# EAGLE design L3D_Display_both_V4 (EAGLE 7.7.0)
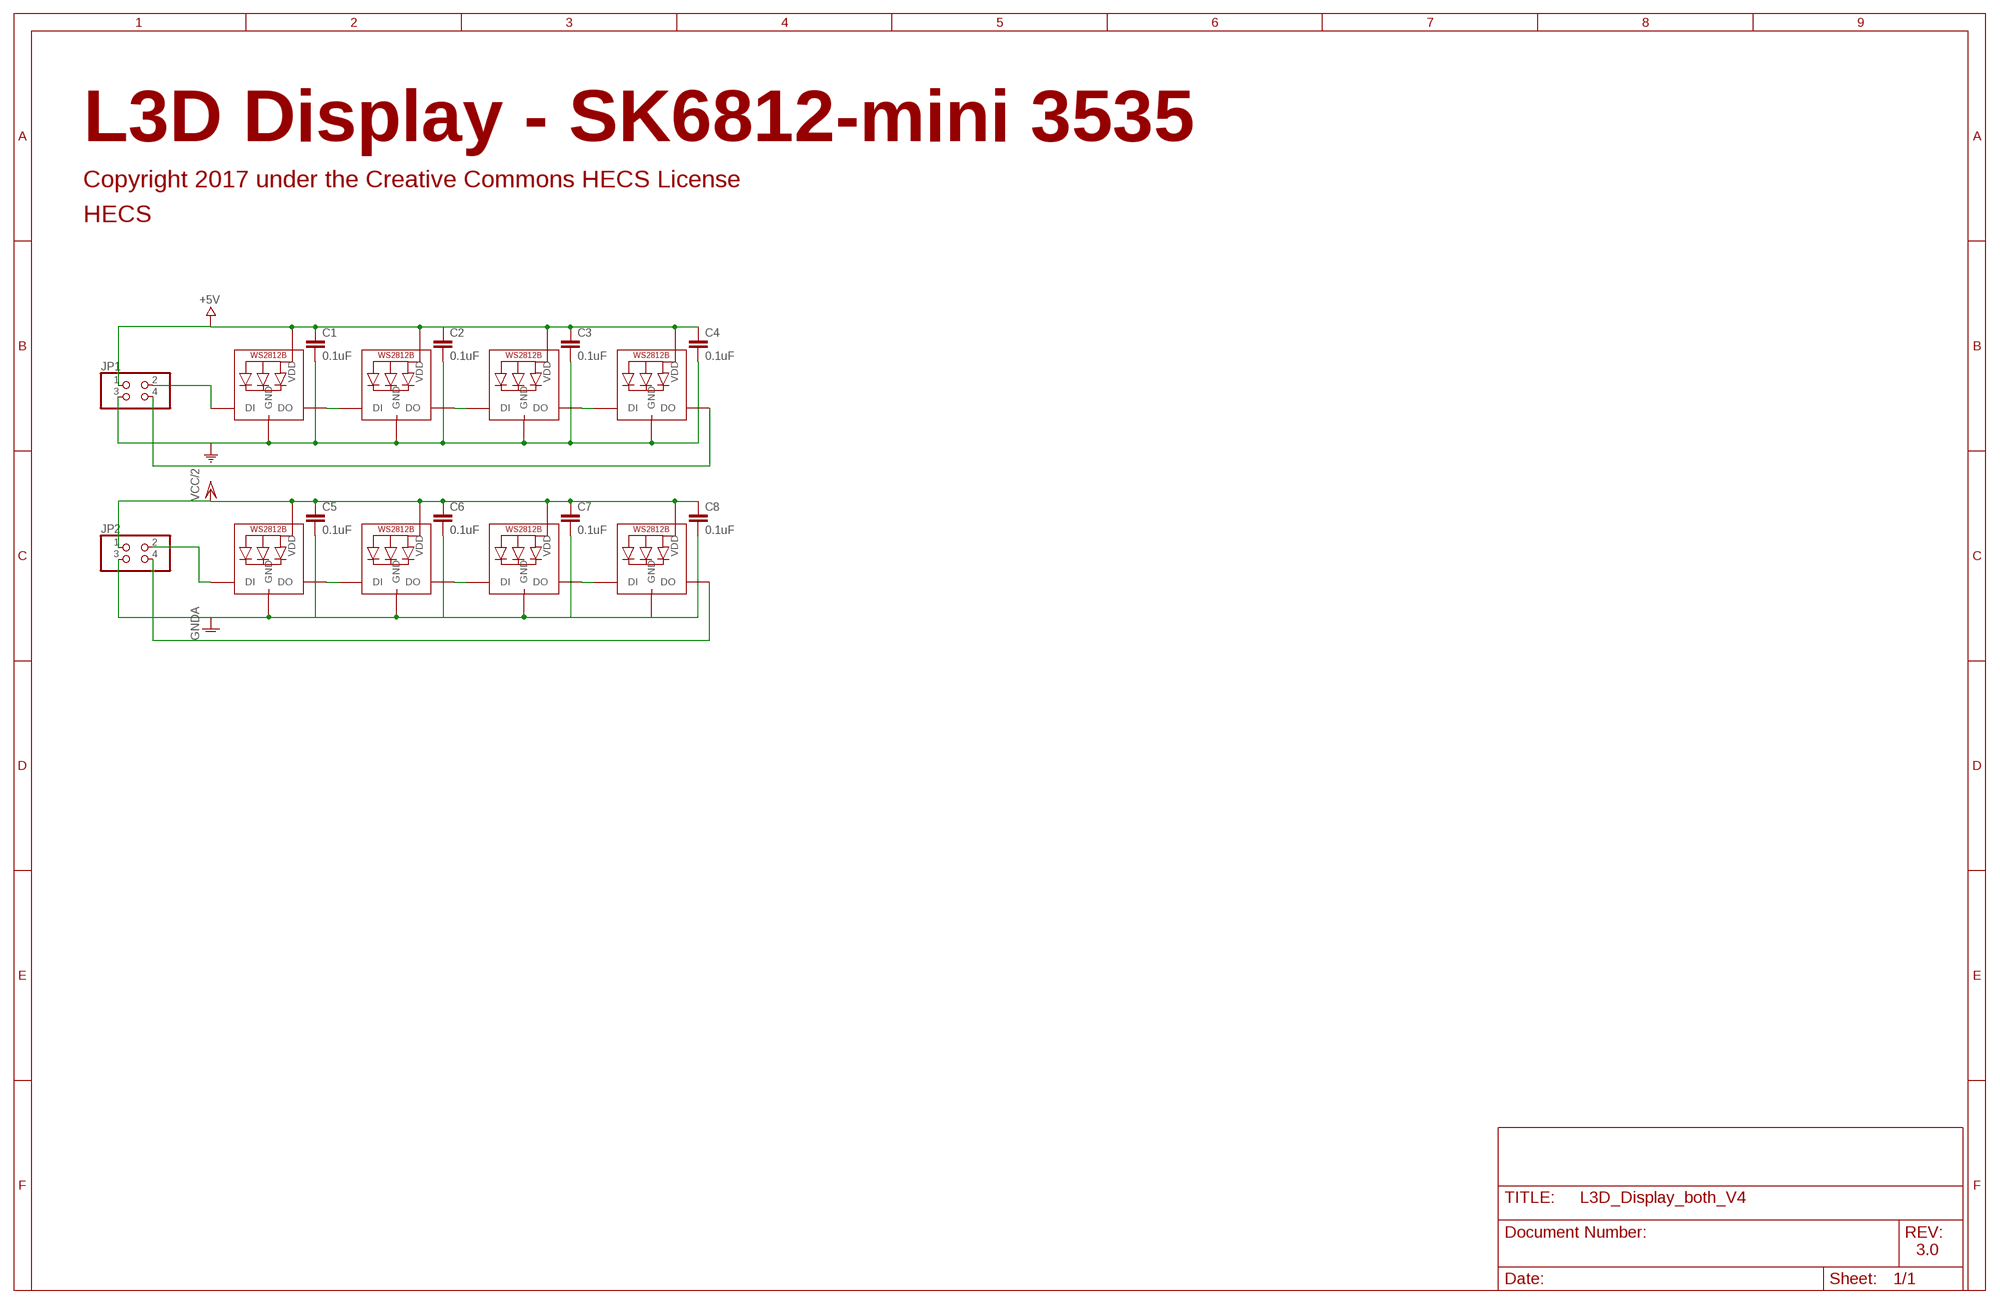
[diagram p0: schematic, sheet 1]

## Parts
C1  0.1uF  0.1UF-0603-25V-(+80/-20%)  [0603]
C2  0.1uF  0.1UF-0603-25V-(+80/-20%)  [0603]
C3  0.1uF  0.1UF-0603-25V-(+80/-20%)  [0603]
C4  0.1uF  0.1UF-0603-25V-(+80/-20%)  [0603]
C5  0.1uF  0.1UF-0603-25V-(+80/-20%)  [0603]
C6  0.1uF  0.1UF-0603-25V-(+80/-20%)  [0603]
C7  0.1uF  0.1UF-0603-25V-(+80/-20%)  [0603]
C8  0.1uF  0.1UF-0603-25V-(+80/-20%)  [0603]
JP1  PINHD-2X2_2.00  [2X02M]
JP2  PINHD-2X2_2.00  [2X02M]
LED1  WS2812B3535  [LED3535]
LED2  WS2812B3535  [LED3535]
LED3  WS2812B3535  [LED3535]
LED4  WS2812B3535  [LED3535]
LED5  WS2812B3535  [LED3535]
LED6  WS2812B3535  [LED3535]
LED7  WS2812B3535  [LED3535]
LED8  WS2812B3535  [LED3535]

## Nets
+5V: C1.1 C2.1 C3.1 C4.1 JP1.1 LED1.2(VDD) LED2.2(VDD) LED3.2(VDD) LED4.2(VDD)
COM: C1.2 C2.2 C3.2 C4.2 JP1.3 LED1.4(GND) LED2.4(GND) LED3.4(GND) LED4.4(GND)
GNDA: C5.2 C6.2 C7.2 C8.2 JP2.3 LED5.1(GND) LED6.1(GND) LED7.1(GND) LED8.1(GND)
N$1: JP1.4 LED4.3(DO)
N$2: LED1.3(DO) LED2.1(DI)
N$3: LED2.3(DO) LED3.1(DI)
N$4: LED3.3(DO) LED4.1(DI)
N$5: LED5.4(DO) LED6.2(DI)
N$6: JP1.2 LED1.1(DI)
N$7: LED6.4(DO) LED7.2(DI)
N$8: LED7.4(DO) LED8.2(DI)
N$9: JP2.2 LED5.2(DI)
N$12: JP2.4 LED8.4(DO)
VCC/2: C5.1 C6.1 C7.1 C8.1 JP2.1 LED5.3(VDD) LED6.3(VDD) LED7.3(VDD) LED8.3(VDD)

## Notes on the sheet
- L3D Display - SK6812-mini 3535
- Copyright 2017 under the Creative Commons HECS License
- HECS
- 3.0

## Library data of the parts
C1-C8 = SparkFun-Capacitors:0.1UF: 0.1µF ceramic capacitors A capacitor is a passive two-terminal electrical component used to store electrical energy temporarily in an electric field.; PROD_ID: CAP-00810
JP1 JP2 = pinhead-1:PINHD-2X2: PIN HEADER
LED1-LED4 = adafruit:WS2812B
LED5-LED8 = WS2812B-3535:WS2812B

## Board
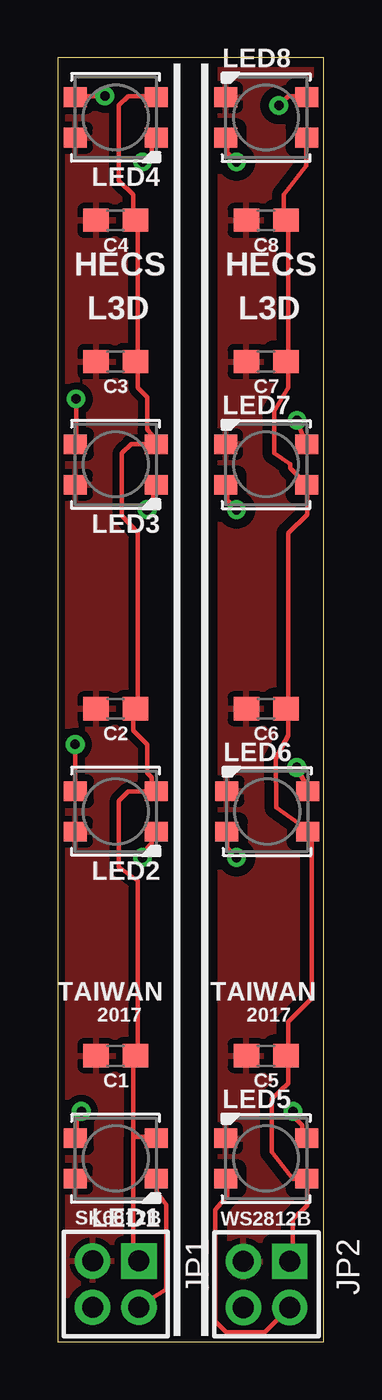
[diagram p1: board, top side]
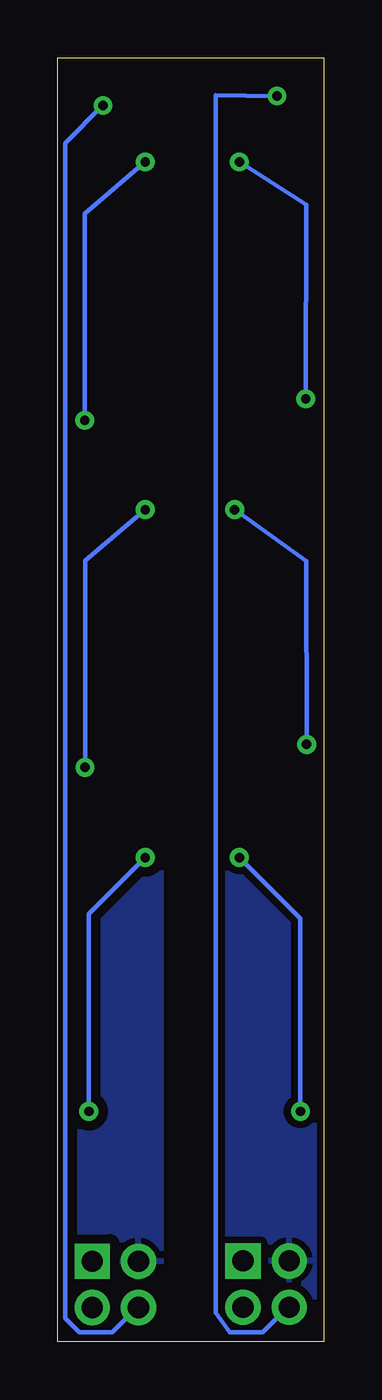
[diagram p2: board, bottom side, seen from below]

Size 11.5 x 55.5 mm. Coordinates in mm from the lower left corner, seen from the top.
Outline: 0,0 11.5,0 11.5,55.5 0,55.5 0,0
Copper layers (1*16): Top 0.035mm / dielectric 1.5mm / Bottom 0.035mm
Design rules "default *": minimum track width 8mil, minimum drill 16mil, track to track 8mil, track to pad 8mil, pad to pad 8mil, via to via 8mil, smd to smd 8mil, copper to edge 8mil, drill to drill 8mil, minimum pad ring 12mil, minimum via ring 8mil, stop-mask expansion 4mil, vias tented up to drill 18mil, thermal gap 10mil
tRestrict: area 5,0.2 to 6.5,55.2
bRestrict: area 5,0.2 to 6.5,55.2

### Footprints (pad centres in the part's own frame; a part is rotated, then mirrored left to right if it is on the bottom)
0603 = smd 1.1 x 1: 1 -0.85,0; 2 0.85,0
2X02M = drill 0.914 square: 1 -1,-1 | drill 0.914: 2 -1,1; 3 1,-1; 4 1,1
LED3535 = smd 1 x 0.85: 1 -1.75,0.875; 2 -1.75,-0.875; 3 1.75,-0.875; 4 1.75,0.875

### Placement (x,y rotation side)
C1  2.5,12.36 180 top
C2  2.5,27.36 180 top
C3  2.5,42.37 180 top
C4  2.5,48.48 180 top
C5  9,12.36 180 top
C6  9,27.36 180 top
C7  9,42.37 180 top
C8  9,48.48 180 top
JP1  2.5,2.49 180 top
JP2  9.02,2.48 180 top
LED1  2.5,7.92 180 top
LED2  2.5,22.92 180 top
LED3  2.5,37.92 180 top
LED4  2.5,52.92 180 top
LED5  9,7.92 0 top
LED6  9.05,22.92 0 top
LED7  9,37.92 0 top
LED8  9,52.92 0 top

### Tracks (layer width: path | path; a pad name or v marks a point on that pad's centre or on a via)
+5V
  Top 0.203: 3.26,8.85 4.27,8.85 4.09,8.8 LED1.2 | 3.26,8.85 3.26,12.19 C1.1 3.45,12.39 3.45,19.93 2.64,20.52 2.64,23.37 3.05,23.77 4.06,23.77 LED2.2 4.06,23.98 4.06,24.38 3.86,24.59 3.86,25.81 3.25,26.42 3.25,27.23 C2.1 3.45,27.43 3.45,34.98 2.77,35.71 2.77,38.41 3.16,38.81 4.06,38.81 | 3.26,8.85 3.26,5.5 3.25,4.88 3.25,3.86 3.45,3.66 JP1.1 | LED4.2 4.06,53.85 3.05,53.85 2.64,53.44 2.64,50.19 3.25,49.58 3.25,48.56 C4.1 3.45,48.36 3.45,42.47 C3.1 3.45,42.27 3.45,41.25 3.86,40.84 3.86,39.42 4.06,39.22 4.06,38.81 | 4.06,38.81 LED3.2
COM
  pour Top (isolate 0.305): 0.25,0.25 0.25,55.25 4.75,55.25 4.75,0.25
  pour Bottom (isolate 0.305): 0.25,0.25 0.25,55.25 4.75,55.25 4.75,0.25
GNDA
  pour Bottom (isolate 0.406): 6.75,0.25 6.75,55.25 11.25,55.25 11.25,0.25
  pour Top (isolate 0.406): 6.75,0.25 6.75,55.25 11.25,55.25 11.25,0.25
N$1  (via drill 0.41)
  Top 0.203: v2.03,53.85 0.81,53.85 LED4.3
  Bottom 0.203: v2.03,53.85 4.67,53.87 4.69,1.26 4.06,0.41 2.64,0.41 1.63,1.42 JP1.4
N$2  (via drill 0.41)
  Top 0.203: v1.02,9.96 0.81,9.75 0.81,8.94 LED1.3 | v3.66,20.93 3.86,21.13 3.86,21.34 4.06,21.54 4.06,21.95 LED2.1
  Bottom 0.203: v1.02,9.96 1.02,18.29 v3.66,20.93
N$3  (via drill 0.41)
  Top 0.203: v0.75,25.82 0.75,23.96 LED2.3 | v3.86,35.97 4.12,36.28 4.1,36.98 4.06,36.98 LED3.1
  Bottom 0.203: v0.75,25.82 0.78,33.76 v3.86,35.97
N$4  (via drill 0.41)
  Top 0.203: v0.79,40.75 0.8,38.82 0.81,38.81 LED3.3 | v3.66,51 3.86,51.21 4.06,51.37 4.06,52.03 LED4.1
  Bottom 0.203: v0.79,40.75 0.76,49.16 v3.66,51
N$5  (via drill 0.41)
  Top 0.203: v10.16,9.96 10.16,9.75 10.57,9.35 10.57,8.94 LED5.4 | v7.72,20.93 7.32,21.34 7.32,21.95 LED6.2
  Bottom 0.203: v10.16,9.96 10.16,18.49 v7.72,20.93
N$6
  Top 0.203: LED1.1 4.27,6.91 4.27,6.5 4.69,5.91 4.69,2.27 3.66,1.63 JP1.2
N$7  (via drill 0.41)
  Top 0.203: v10.32,24.83 10.77,23.98 LED6.4 | v7.72,35.97 7.32,36.37 7.32,36.98 LED7.2
  Bottom 0.203: v10.32,24.83 10.32,33.77 v7.72,35.97
N$8  (via drill 0.41)
  Top 0.203: v10.34,39.83 10.57,39.22 10.57,38.81 LED7.4 | v7.72,51 7.32,51.41 7.32,52.02 LED8.2
  Bottom 0.203: v10.34,39.83 10.34,48.77 v7.72,51
N$9
  Top 0.203: LED5.2 7.32,6.91 7.32,6.3 6.79,5.69 6.81,0.89 7.28,0.41 8.94,0.41 9.96,1.42 JP2.2
N$12  (via drill 0.41)
  Top 0.203: v9.55,53.44 9.96,53.85 10.57,53.85 LED8.4
  Bottom 0.203: v9.55,53.44 11.18,51.82 11.18,1.02 10.57,0.41 9.14,0.41 8.13,1.42 JP2.4
VCC/2
  Top 0.203: LED8.3 10.74,52.01 10.74,50.84 9.75,49.58 9.75,48.56 C8.1 9.96,48.36 9.96,42.47 C7.1 9.96,42.27 9.96,41.25 9.35,40.23 9.35,38.42 10.03,37.94 10.03,37.76 LED7.3 10.77,36.98 10.77,35.76 9.96,34.95 9.96,27.43 C6.1 9.96,27.23 9.96,26.21 9.42,25.21 9.44,23.1 10.71,22.19 10.77,22.15 LED6.3 10.97,21.95 10.97,14.83 9.96,13.82 9.96,12.39 C5.1 9.96,12.19 9.96,11.16 9.25,10.5 9.25,8.22 10.16,7.05 10.57,7.05 LED5.3 10.77,6.91 10.77,5.89 10.16,5.28 10.16,3.66 JP2.1
  Top 0.406: C8.1

### Text on the board
tPlace: HECS | HECS | L3D | L3D | TAIWAN | TAIWAN | 2017 | 2017 | SK6812B | WS2812B